# Altium schematic sheet ETHERNET.SchDoc
size A3; SheetNumber: 7; SheetTotal: 14
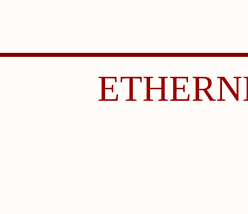
[diagram p0: ETHERNET.SchDoc, top left]
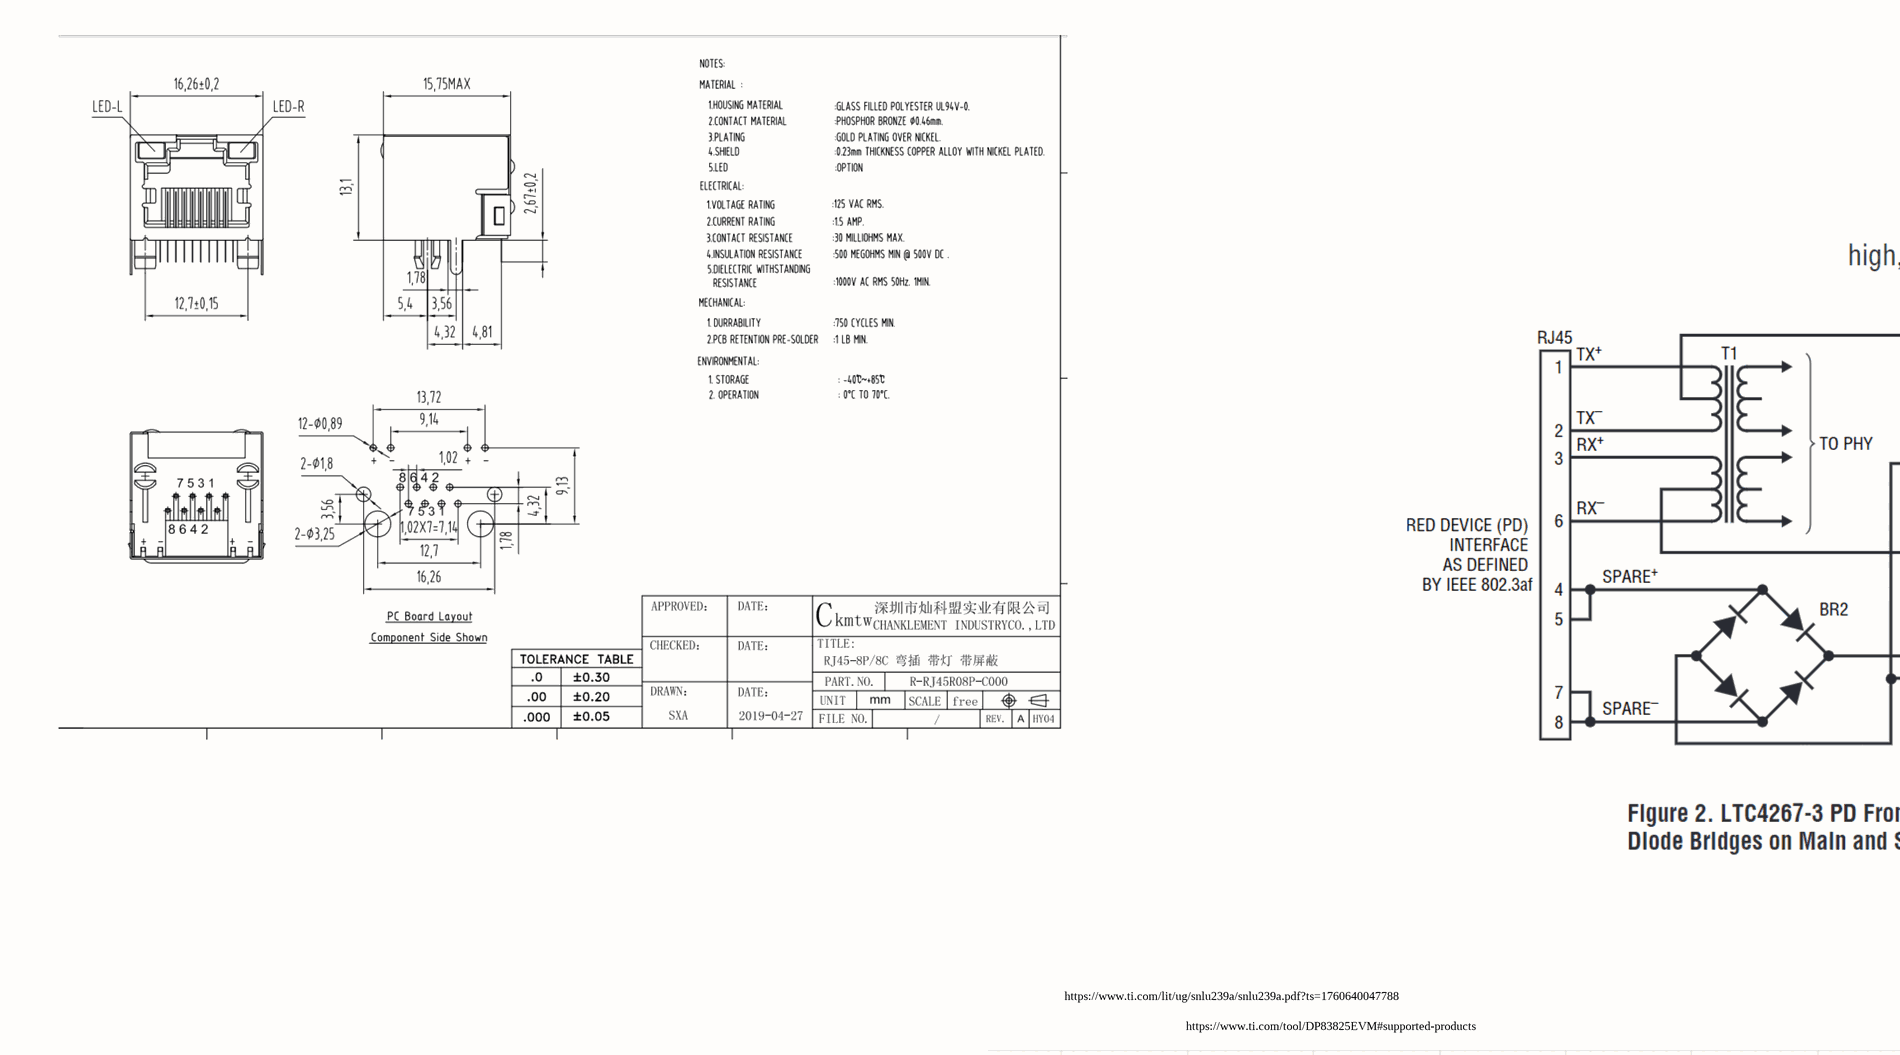
[diagram p1: ETHERNET.SchDoc, top middle]
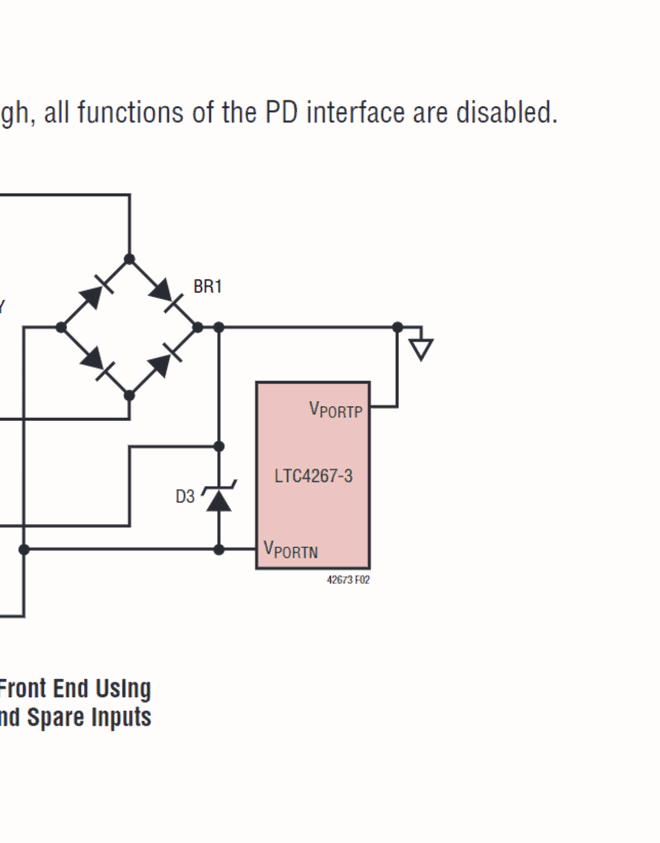
[diagram p2: ETHERNET.SchDoc, top right]
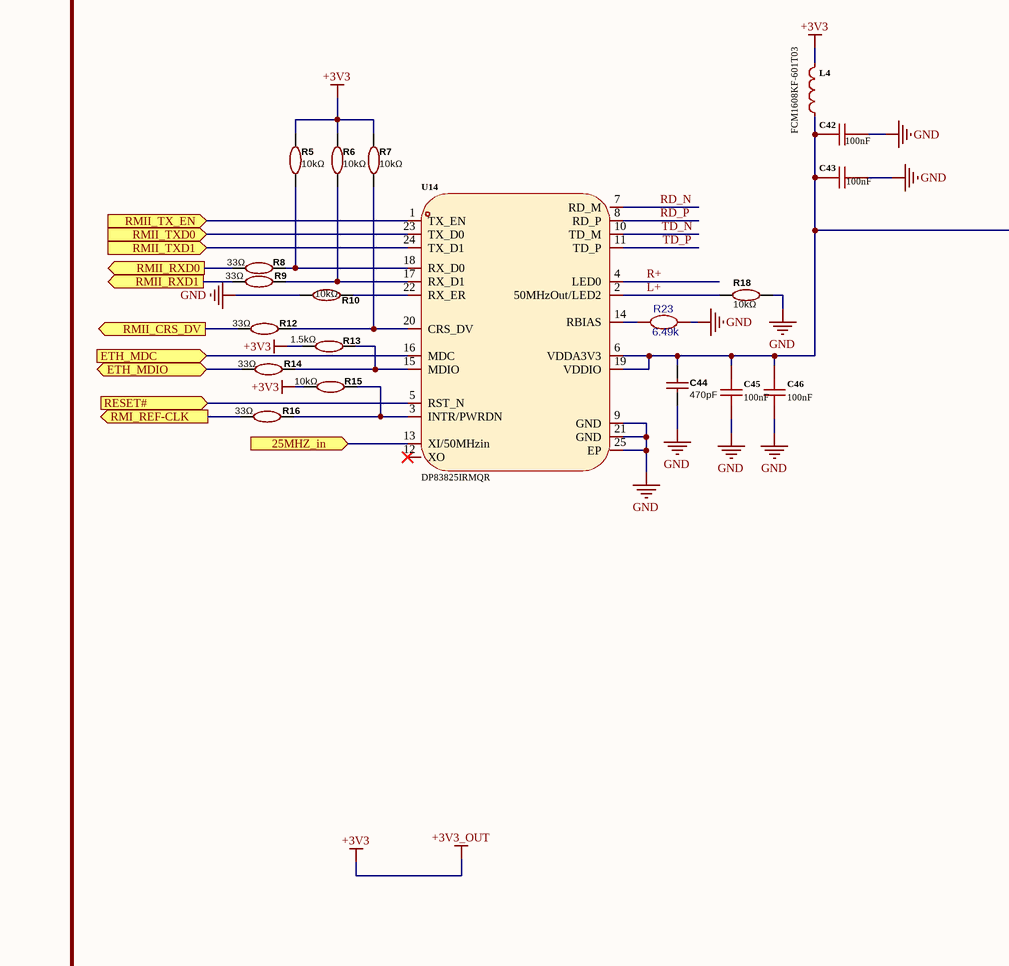
[diagram p3: ETHERNET.SchDoc, centre left]
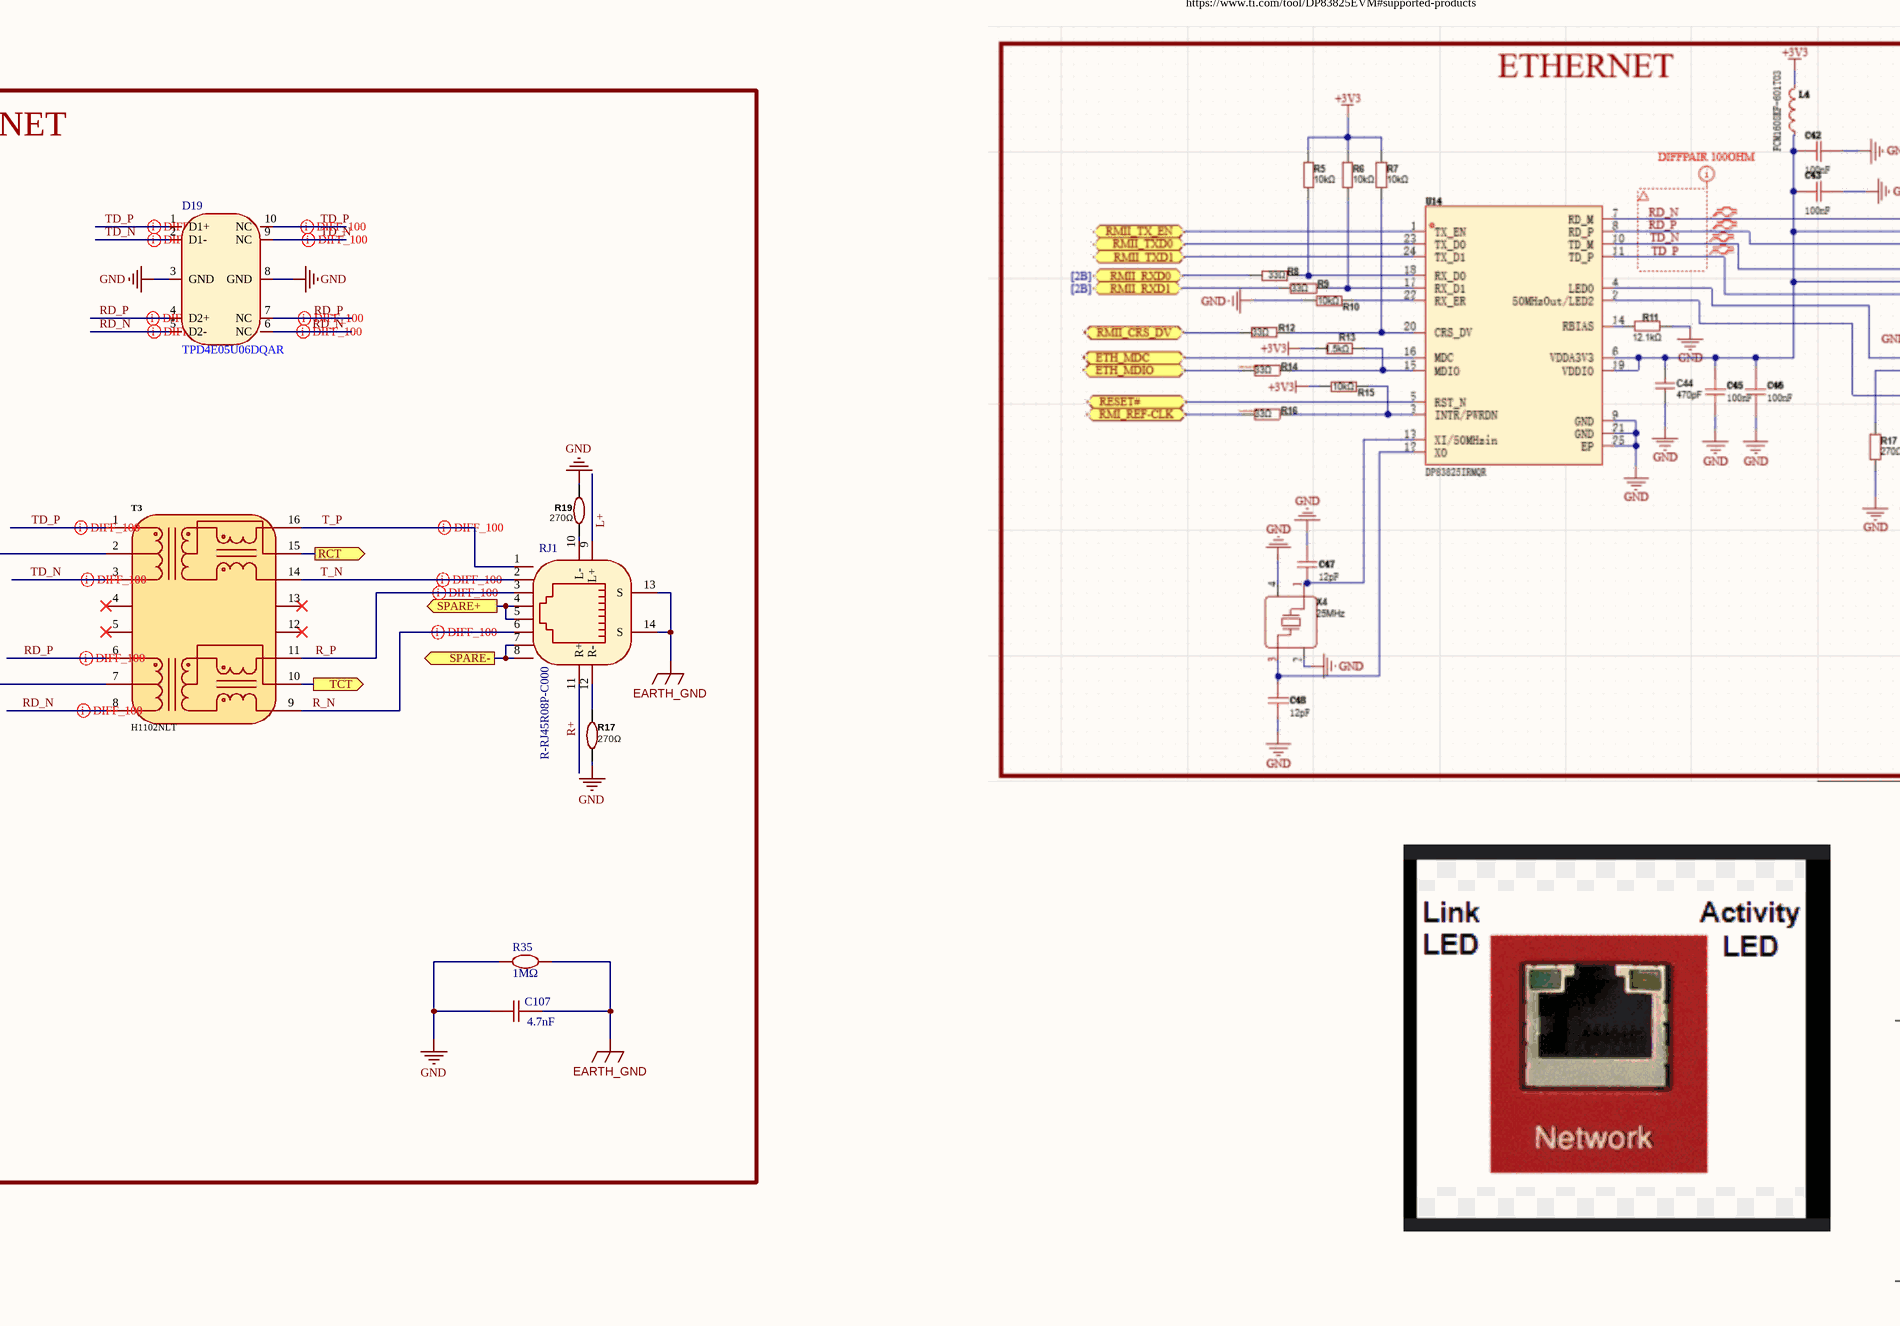
[diagram p4: ETHERNET.SchDoc, centre middle]
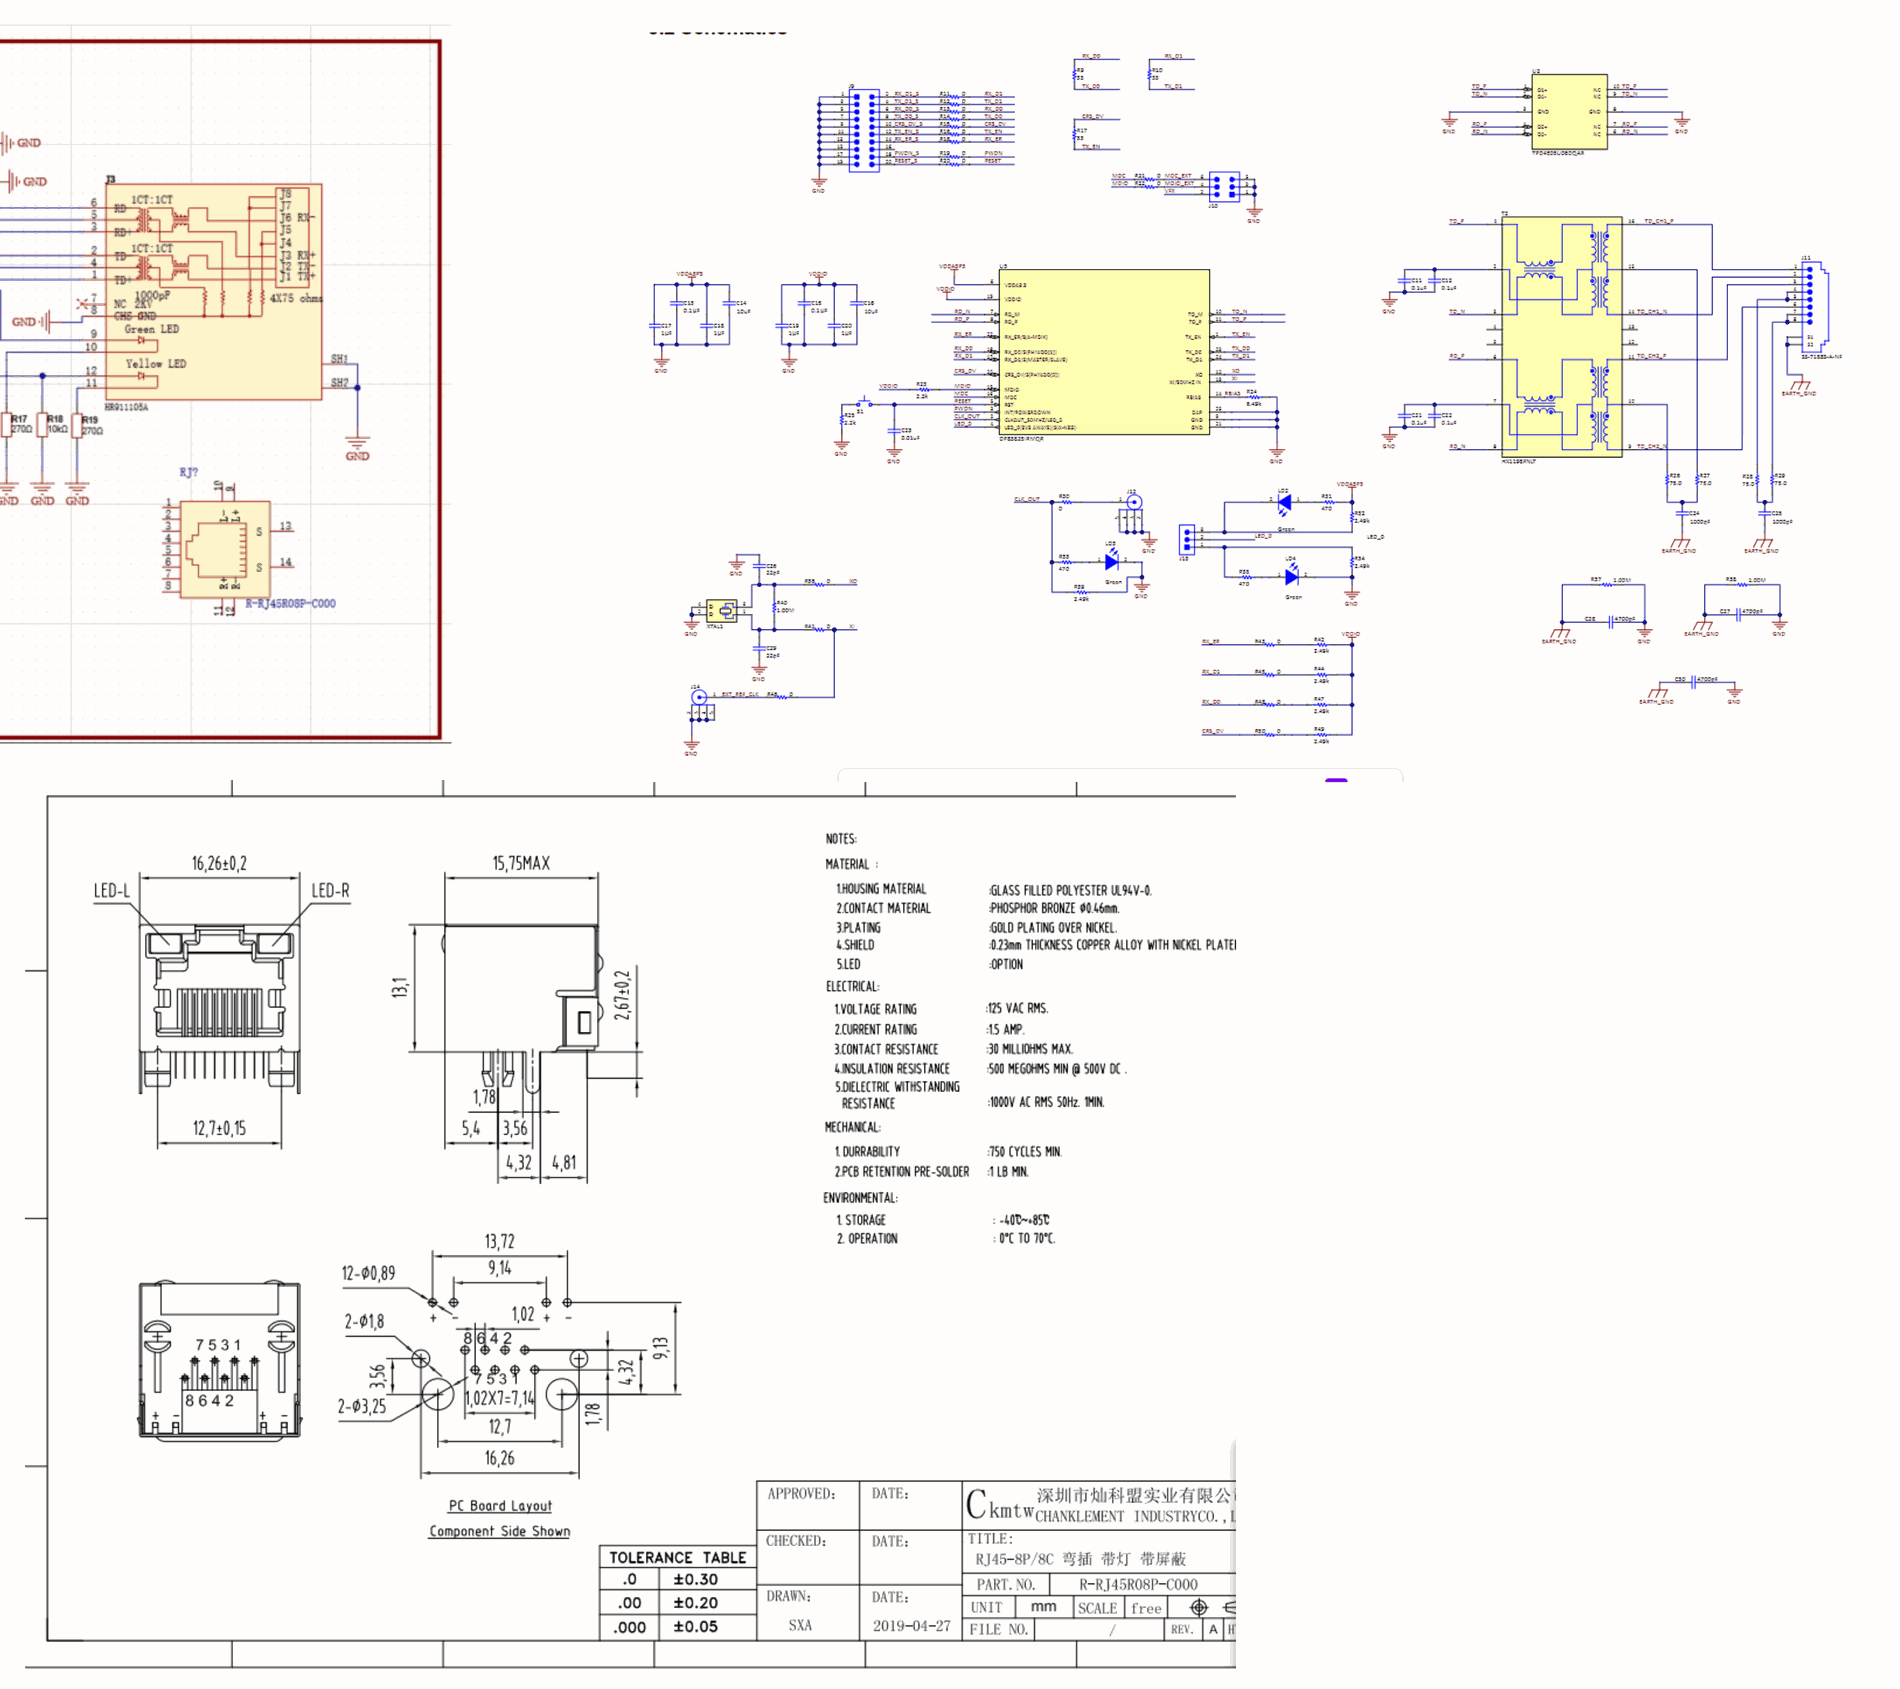
[diagram p5: ETHERNET.SchDoc, centre right]
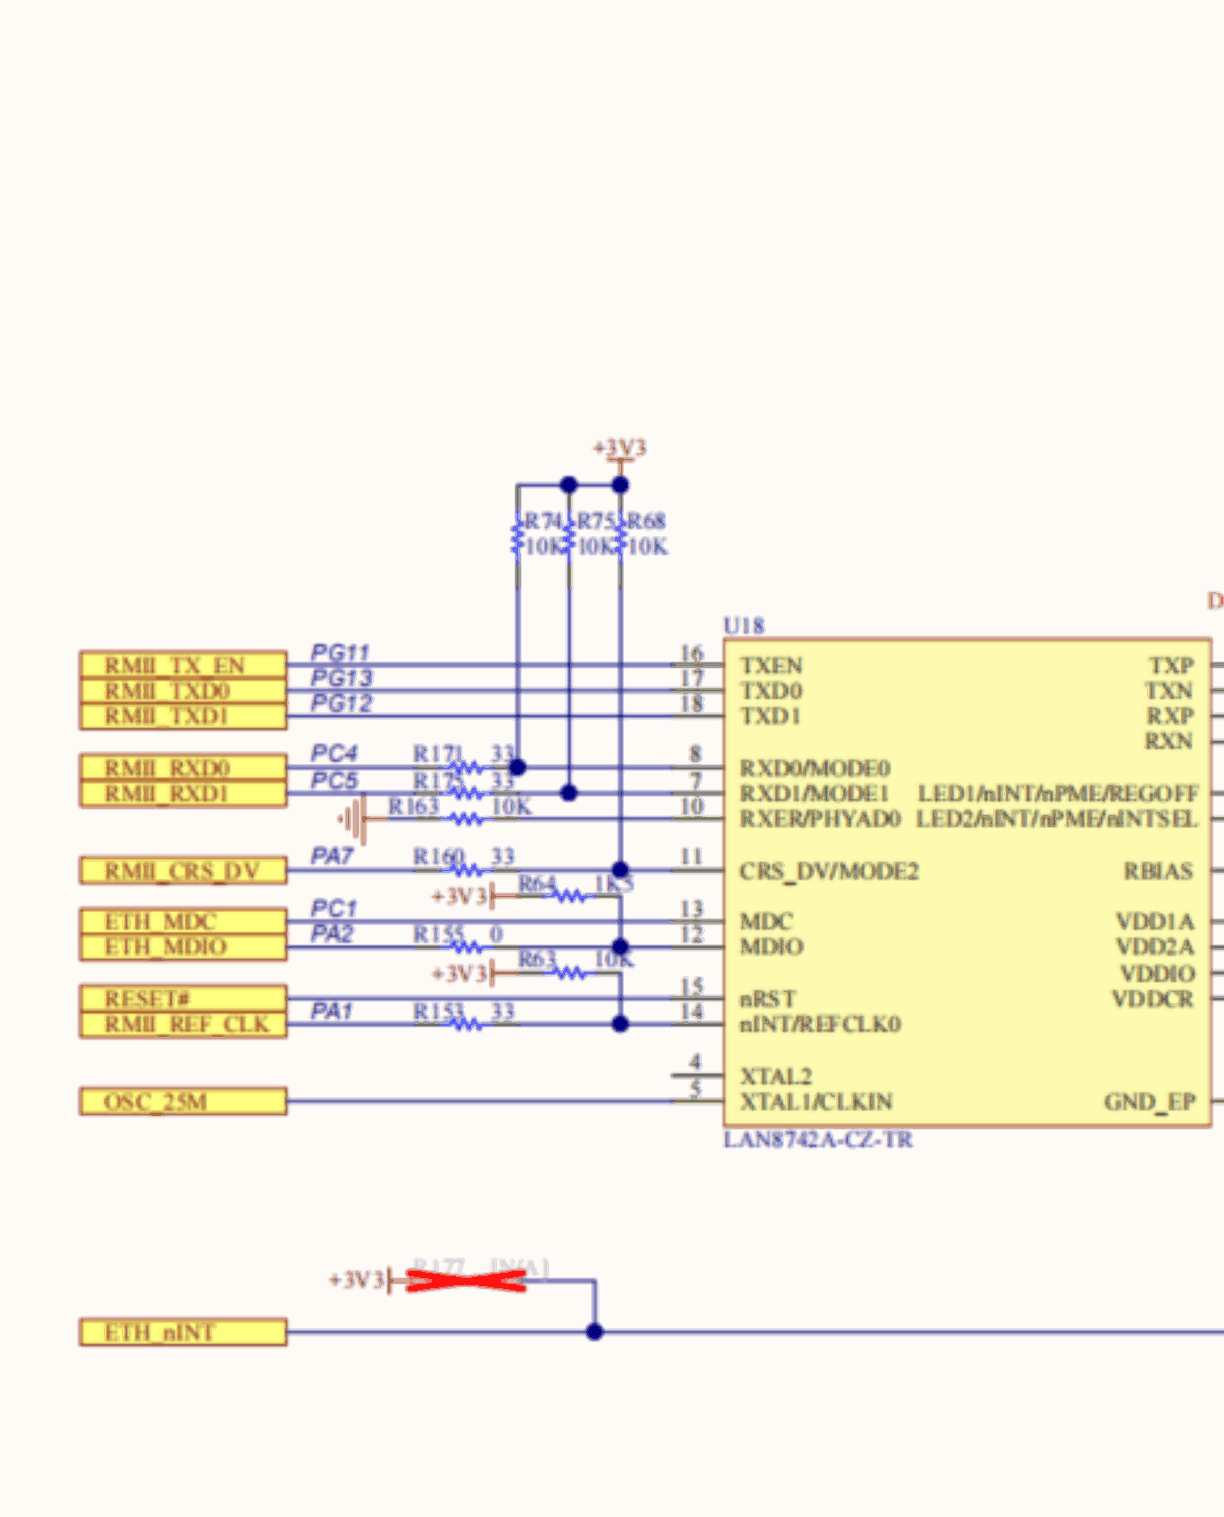
[diagram p6: ETHERNET.SchDoc, bottom left]
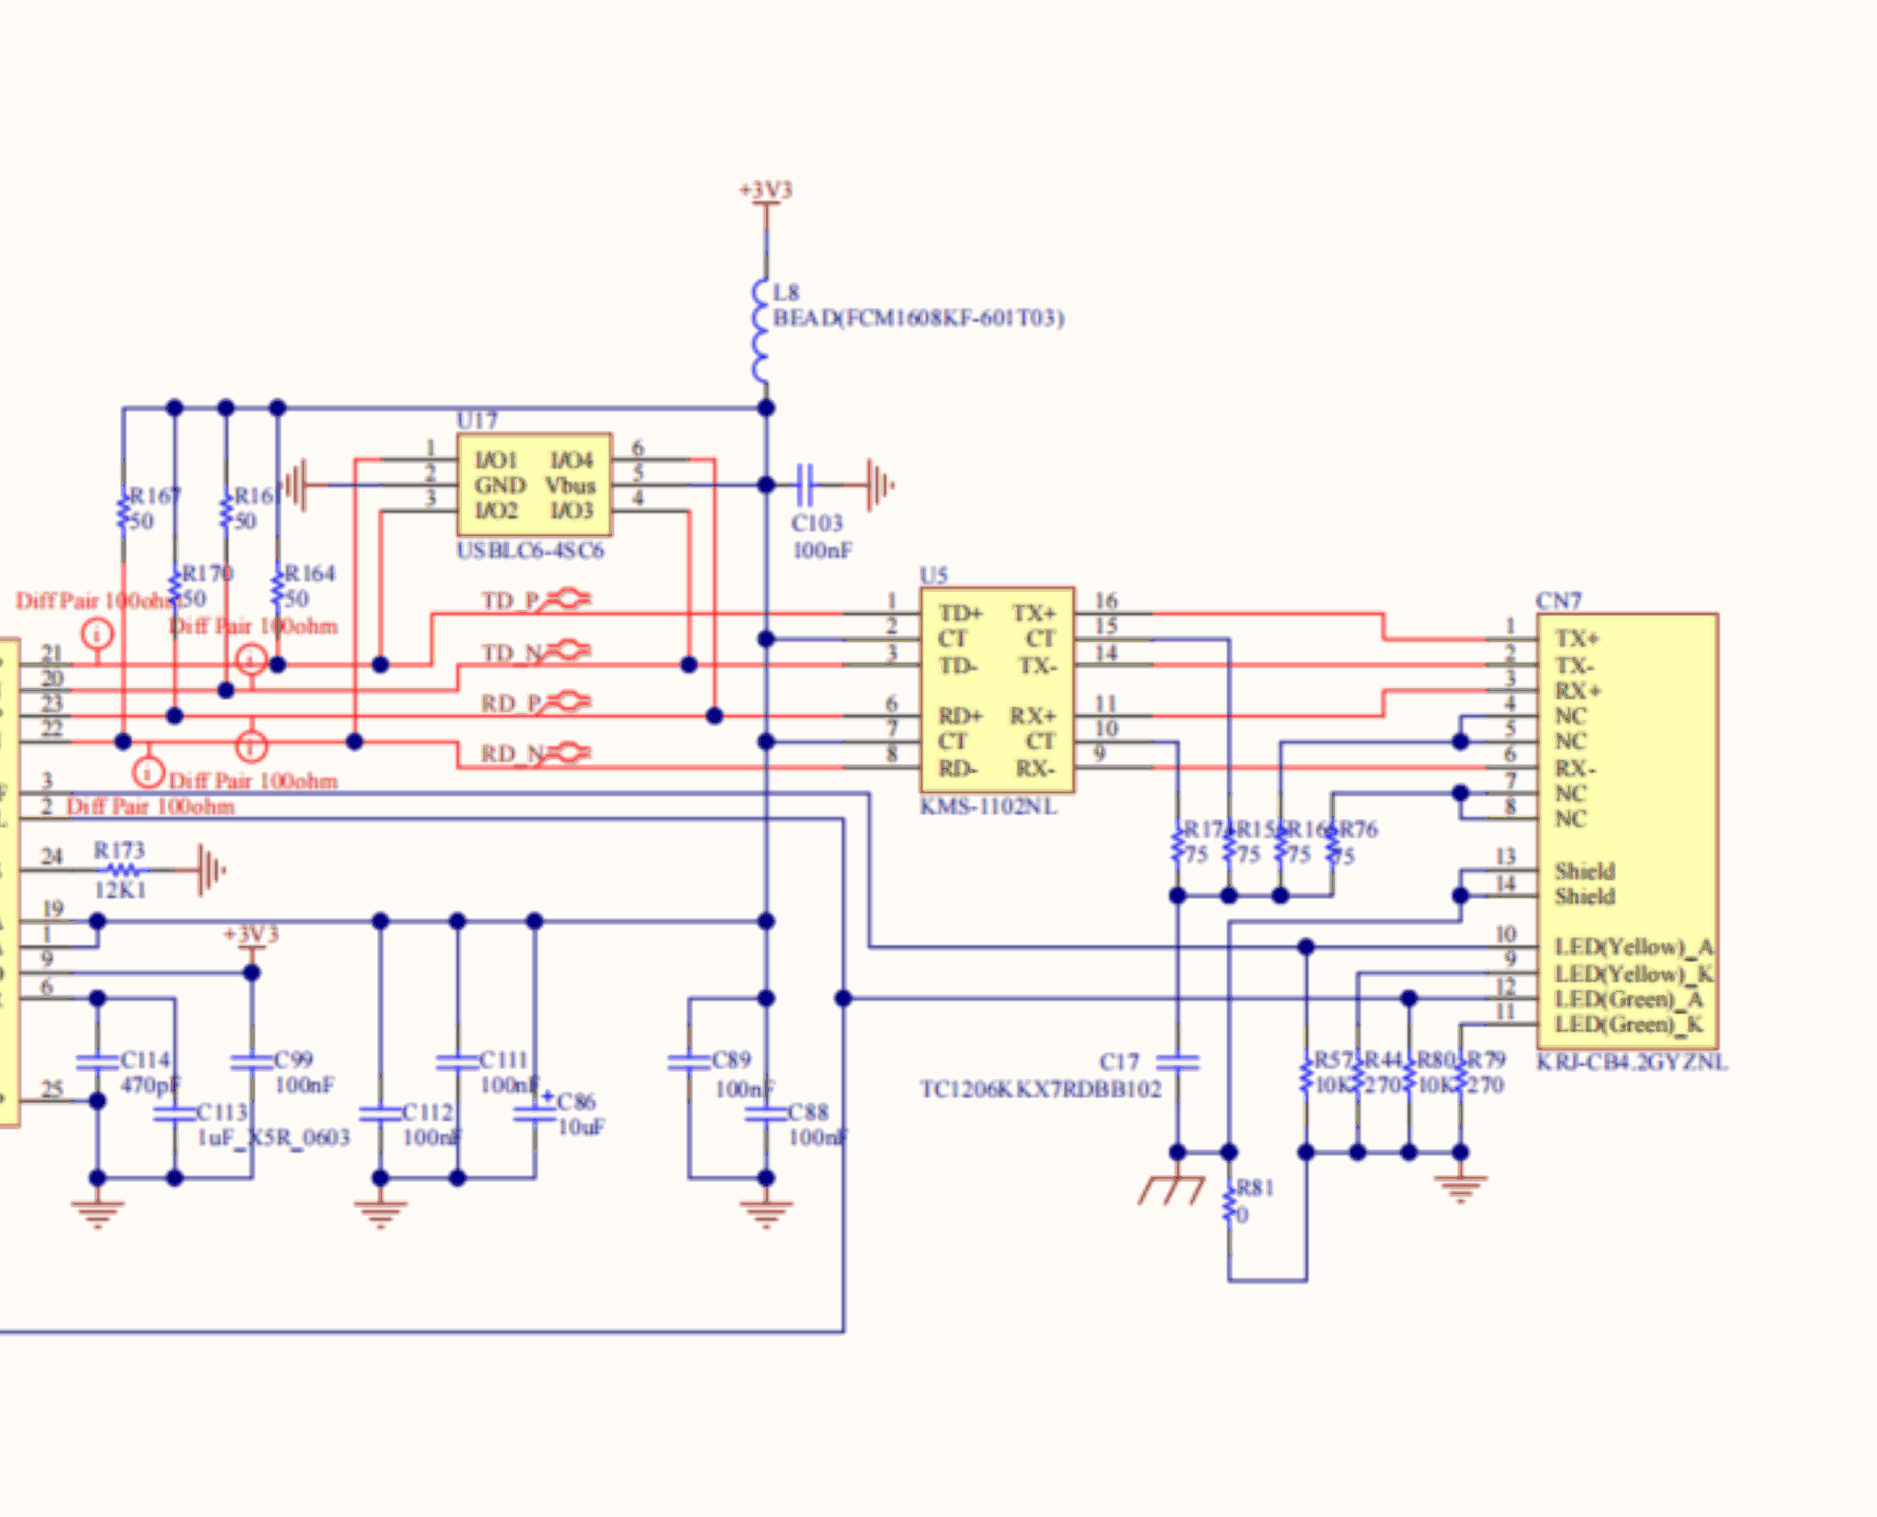
[diagram p7: ETHERNET.SchDoc, bottom middle]

## Parts
C42  100nF  [C_0603]
C43  100nF  [C_0603]
C44  470pF  [C_0603]
C45  100nF  [C_0603]
C46  100nF  [C_0603]
C107  4.7nF  [C1812]
D19  TPD4E05U06DQAR  [USON-10_L2.5-W1.0-P0.50-BL]
L4  FCM1608KF-601T03  [R_0603]
R5  10kΩ  [R_0603]
R6  10kΩ  [R_0603]
R7  10kΩ  [R_0603]
R8  33Ω  [R_0603]
R9  33Ω  [R_0603]
R10  10kΩ  [R_0603]
R12  33Ω  [R_0603]
R13  1.5kΩ  [R_0603]
R14  33Ω  [R_0603]
R15  10kΩ  [R_0603]
R16  33Ω  [R_0603]
R17  270Ω  [R_0603]
R18  10kΩ  [R_0603]
R19  270Ω  [R_0603]
R23  6.49k  [R_0603]
R35  1MΩ  [R2010]
RJ1  R-RJ45R08P-C000  [RJ45-TH_R-RJ45R08P-C000]
T3  H1102NLT  [XFMR-SMD_H1102NLT]
U14  DP83825IRMQR  [HVQFN-24_L3.0-W3.0-P0.40-TL-EP1.9]

## Blocks framed on the sheet
ETHERNET: C42-C46 C107 D19 L4 R5-R10 R12-R19 R23 R35 RJ1 T3 U14

## Ports
25MHZ_in (in), ETH_MDC (in), ETH_MDIO (bidir), RCT (out), RESET# (in), RMI_REF-CLK (out), RMII_CRS_DV (out), RMII_RXD0 (out), RMII_RXD1 (out), RMII_TX_EN (in), RMII_TXD0 (in), RMII_TXD1 (in), SPARE+ (out), SPARE- (out), TCT (out)

## Nets
+3V3: L4.2 R5.1 R6.1 R7.1 R13.1 R15.2  [also labelled +3V3_OUT]
EARTH_GND: C107.1 R35.2 RJ1.13(S) RJ1.14(S)
GND: C42.2 C43.2 C44.1 C45.2 C46.2 C107.2 D19.3(GND) D19.8(GND) R10.2 R17.1 R18.1 R19.1 R23.2 R35.1 U14.9(GND) U14.21(GND) U14.25(EP)
25MHZ_in: U14.13(XI/50MHzin) ; port 25MHZ_in
ETH_MDC: U14.16(MDC) ; port ETH_MDC
ETH_MDIO: R14.1 ; port ETH_MDIO
L+: R18.2 RJ1.9(L+) U14.2(50MHzOut/LED2)
R+: RJ1.11(R+) U14.4(LED0)
R_N: RJ1.6 T3.9
R_P: RJ1.3 T3.11
RCT: T3.15 ; port RCT
RD_N: D19.5(D2-) D19.6(NC) T3.8 U14.7(RD_M)
RD_P: D19.4(D2+) D19.7(NC) T3.6 U14.8(RD_P)
RESET#: U14.5(RST_N) ; port RESET#
RMI_REF-CLK: R16.1 ; port RMI_REF-CLK
RMII_CRS_DV: R12.1 ; port RMII_CRS_DV
RMII_RXD0: R8.1 ; port RMII_RXD0
RMII_RXD1: R9.1 ; port RMII_RXD1
RMII_TX_EN: U14.1(TX_EN) ; port RMII_TX_EN
RMII_TXD0: U14.23(TX_D0) ; port RMII_TXD0
RMII_TXD1: U14.24(TX_D1) ; port RMII_TXD1
SPARE+: RJ1.4 RJ1.5 ; port SPARE+
SPARE-: RJ1.7 RJ1.8 ; port SPARE-
T_N: RJ1.2 T3.14
T_P: RJ1.1 T3.16
TCT: T3.10 ; port TCT
TD_N: D19.2(D1-) D19.9(NC) T3.3 U14.10(TD_M)
TD_P: D19.1(D1+) D19.10(NC) T3.1 U14.11(TD_P)
NetC42_1: C42.1 C43.1 C44.2 C45.1 C46.1 L4.1 T3.2 T3.7 U14.6(VDDA3V3) U14.19(VDDIO)
NetR5_2: R5.2 R8.2 U14.18(RX_D0)
NetR6_2: R6.2 R9.2 U14.17(RX_D1)
NetR7_2: R7.2 R12.2 U14.20(CRS_DV)
NetR10_1: R10.1 U14.22(RX_ER)
NetR13_2: R13.2 R14.2 U14.15(MDIO)
NetR15_1: R15.1 R16.2 U14.3(INTR/PWRDN)
NetR17_2: R17.2 RJ1.12(R-)
NetR19_2: R19.2 RJ1.10(L-)
NetR23_1: R23.1 U14.14(RBIAS)

Not connected (* = marked no-connect by the designer): T3 4* 5* 12* 13*; U14 12(XO)*

## Layout directives
differential pair; differential pair class DIFF_100: R_N, R_P, RD_N, RD_P, T_N, T_P, TD_N, TD_P

## Notes on the sheet
- https://www.ti.com/lit/ug/snlu239a/snlu239a.pdf?ts=1760640047788
- https://www.ti.com/tool/DP83825EVM#supported-products
- Project Name:
- Size:
- Date:
- A3
- Version:
- Time:
- V1.4.0.0
- Sheet:
- Of
- File:

## Library data of the parts
C42 C43 C45 C46 = CC0603KRX7R9BB104: Manufacturer: YAGEO(国巨); Add into BOM: yes; Tolerance: ±10%; Voltage Rating: 50V; Temperature Coefficient: X7R; Symbol: CC0603KRX7R9BB104; Device: CC0603KRX7R9BB104; LCSC Part Name: 100nF ±10% 50V; Supplier Part: C14663; Manufacturer Part: CC0603KRX7R9BB104; Supplier Footprint: 0603; JLCPCB Part Class: Basic Part; Datasheet: https://item.szlcsc.com/datasheet/CC0603KRX7R9BB104/15331.html; Supplier: LCSC; Convert to PCB: yes; Value: 100nF
C44 = 470pF: Manufacturer: YAGEO(国巨); Manufacturer Part: CC0603KRX7R9BB471; nameAlias: Value; Supplier: LCSC; Supplier Part: C107092; JLCPCB Part Class: Extended Part; spicePre: C; spiceSymbolName: CC0603KRX7R9BB471
C107 = CC1812KKX7RDBB472: Manufacturer: YAGEO(国巨); Add into BOM: yes; Tolerance: ±10%; Voltage Rating: 2kV; Temperature Coefficient: X7R; Symbol: CC1812KKX7RDBB472; Device: CC1812KKX7RDBB472; LCSC Part Name: 4.7nF ±10% 2kV; Supplier Part: C309511; Manufacturer Part: CC1812KKX7RDBB472; Supplier Footprint: 1812; JLCPCB Part Class: Extended Part; Datasheet: https://item.szlcsc.com/datasheet/CC1812KKX7RDBB472/293127.html; Supplier: LCSC; Convert to PCB: yes; Value: 4.7nF
D19 = TPD4E05U06DQAR_C138714: Manufacturer: TI(德州仪器); Add into BOM: yes; Polarity: Unidirectional; Reverse Stand-Off Voltage (Vrwm): 5.5V; Clamping Voltage: 14V; Peak Pulse Current (Ipp): 2.5A@8/20us; Peak Pulse Power Dissipation (Ppp): 40W@8/20us; Voltage - Breakdown: 6.5V; Reverse Leakage Current (Ir): 10nA; Number of Channels: 4; level of protection: IEC 61000-4-4；IEC 61000-4-5；IEC 61000-4-2; Type: TVS; Junction Capacitance: 0.5pF; Symbol: TPD4E05U06DQAR_C138714; Device: TPD4E05U06DQAR_C138714; LCSC Part Name: 单向ESD; Supplier Part: C138714; Manufacturer Part: TPD4E05U06DQAR; Supplier Footprint: USON-10(1x2.5); JLCPCB Part Class: Extended Part; Datasheet: https://www.ti.com/cn/lit/gpn/tpd4e05u06; Supplier: LCSC; Convert to PCB: yes; Operating Temperature: -40℃~+125℃
L4 = FCM1608KF-601T03: Manufacturer: TAI-TECH(台庆); Add into BOM: yes; Impedance @ Frequency: 600Ω@100MHz; Tolerance: ±25%; DC Resistance(DCR): 500mΩ; Current Rating: 350mA; Number of Circuits: 1; Symbol: FCM1608KF-601T03; Device: FCM1608KF-601T03; LCSC Part Name: 单路 0603磁珠 阻抗600Ω@100MHz; Supplier Part: C141723; Manufacturer Part: FCM1608KF-601T03; Supplier Footprint: 0603; JLCPCB Part Class: Extended Part; Datasheet: https://item.szlcsc.com/datasheet/FCM1608KF-601T03/153054.html; Supplier: LCSC; Convert to PCB: yes
R5-R7 R10 R15 R18 = 10kΩ: Manufacturer: YAGEO(国巨); Manufacturer Part: RC0603FR-0710KL; nameAlias: Value; Supplier: LCSC; Supplier Part: C98220; JLCPCB Part Class: Extended Part; spicePre: R; spiceSymbolName: RC0603FR-0710KL
R8 R9 R12 R14 R16 = 33Ω: Manufacturer: YAGEO(国巨); Manufacturer Part: RC0603FR-0733RL; nameAlias: Value; Supplier: LCSC; Supplier Part: C108661; JLCPCB Part Class: Extended Part; spicePre: R; spiceSymbolName: RC0603FR-0733RL
R13 = 1.5kΩ: Manufacturer: UNI-ROYAL(厚声); Manufacturer Part: 0603WAF1501T5E; nameAlias: Value; Supplier: LCSC; Supplier Part: C22843; JLCPCB Part Class: Basic Part; spicePre: R; spiceSymbolName: 0603WAF1501T5E
R17 R19 = 270Ω: Manufacturer: YAGEO(国巨); Manufacturer Part: RC0603FR-07270RL; nameAlias: Value; Supplier: LCSC; Supplier Part: C137754; JLCPCB Part Class: Extended Part; spicePre: R; spiceSymbolName: RC0603FR-07270RL
R23 = 6.49kΩ: Manufacturer: YAGEO(国巨); Manufacturer Part: RT0603BRC076K49L; nameAlias: Value; Contributor: lcsc; Supplier: LCSC; Supplier Part: C860999; JLCPCB Part Class: Extended Part; spicePre: U; spiceSymbolName: RT0603BRC076K49L
R35 = RCV20101M00FKEFAT: Manufacturer: VISHAY(威世); Add into BOM: yes; Tolerance: ±1%; Power(Watts): 750mW; Voltage-Supply(Max): 2kV; Temperature Coefficient: ±100ppm/℃; Symbol: RCV20101M00FKEFAT; Device: RCV20101M00FKEFAT; LCSC Part Name: 厚膜电阻 1MΩ ±1% 750mW; Supplier Part: C1513439; Manufacturer Part: RCV20101M00FKEFAT; Supplier Footprint: 2010; JLCPCB Part Class: Extended Part; Datasheet: https://atta.szlcsc.com/upload/public/pdf/source/20210531/5E5F97DE5A0A27C89BE556AD1B7EFE5C.pdf; Supplier: LCSC; Convert to PCB: yes; Type: Thick Film Resistors; Value: 1MΩ; Operating Temperature: -55℃~+155℃
RJ1 = R-RJ45R08P-C000: Manufacturer: Ckmtw(灿科盟); Add into BOM: yes; Connector Type: RJ45Receptacle; Number of Ports: 1; Shielding: 有屏蔽; LED: WithLED; Supplementary Features: 鱼叉脚(塑料); Symbol: R-RJ45R08P-C000; Device: R-RJ45R08P-C000; LCSC Part Name: 弯插 带LED; Supplier Part: C386757; Manufacturer Part: R-RJ45R08P-C000; Supplier Footprint: 插件; JLCPCB Part Class: Extended Part; Datasheet: https://atta.szlcsc.com/upload/public/pdf/source/20190508/C386757_590BCC8A33AAEEF7838490D656B2E4CF.pdf; Supplier: LCSC; Convert to PCB: yes; Mounting Style: Right-Angle; Ratings: -; Contact Material: -; Contact Plating: -; Operating Temperature Range: 0℃~+70℃; Soldering Temperature(Max): -; PoE: -
T3 = H1102NLT_C20623173: Manufacturer: DEXU(德旭电子); Add into BOM: yes; port: 单口; rate: 10/100M; Symbol: H1102NLT_C20623173; Device: H1102NLT_C20623173; LCSC Part Name: H1102NLT; Supplier Part: C20623173; Manufacturer Part: H1102NLT; Supplier Footprint: SMD-16P,12.7x9.5mm; JLCPCB Part Class: Extended Part; Datasheet: https://atta.szlcsc.com/upload/public/pdf/source/20240221/C17B427D958C9B2A67A52A591C4EE00A.pdf; Supplier: LCSC; Convert to PCB: yes; Turns Ratio: -; function: -; Inductor: -; HI-POT: -; operating temperature: 0℃~+70℃
U14 = DP83825IRMQR: Manufacturer: TI(德州仪器); Add into BOM: yes; MAC Interface: RMII; Voltage - Supply: 1.8V；3.3V; Symbol: DP83825IRMQR; Device: DP83825IRMQR; LCSC Part Name: DP83825I低功耗10/100Mbps以太网物理层收发器; Supplier Part: C783599; Manufacturer Part: DP83825IRMQR; Supplier Footprint: HVQFN-24-EP(3x3); JLCPCB Part Class: Extended Part; Datasheet: https://www.ti.com/cn/lit/gpn/dp83825i; Supplier: LCSC; Convert to PCB: yes; Applications Function: -; Number of Channels: -; Operating Temperature: -40℃~+85℃